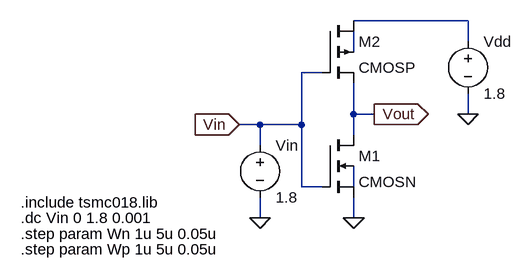
[diagram p0: schematic Assignment 6.asc]
Assignment 6.asc, the LTspice schematic file:
Version 4
SHEET 1 880 680
WIRE 224 -64 48 -64
WIRE 224 -32 224 -64
WIRE 48 -16 48 -48
WIRE 0 16 -32 16
WIRE 48 80 48 32
WIRE 80 80 48 80
WIRE 224 80 224 48
WIRE -96 96 -128 96
WIRE -32 96 -32 16
WIRE -32 96 -96 96
WIRE 48 112 48 80
WIRE -96 128 -96 96
WIRE -32 192 -32 96
WIRE 0 192 -32 192
WIRE 48 192 48 160
WIRE -96 240 -96 208
WIRE 48 240 48 208
FLAG 80 80 Vout
IOPIN 80 80 Out
FLAG -96 240 0
FLAG 48 240 0
FLAG 224 80 0
FLAG -128 96 Vin
IOPIN -128 96 In
SYMBOL cmosn 0 112 R0
SYMATTR InstName M1
SYMATTR Value2 l=180n w={Wn}
SYMBOL cmosp 0 -64 R0
SYMATTR InstName M2
SYMATTR Value2 l=180n w={Wp}
SYMBOL voltage -96 112 R0
SYMATTR InstName Vin
SYMATTR Value 1.8
SYMBOL voltage 224 -48 R0
SYMATTR InstName Vdd
SYMATTR Value 1.8
TEXT -464 216 Left 2 !.include tsmc018.lib
TEXT -464 240 Left 2 !.dc Vin 0 1.8 0.001
TEXT -464 288 Left 2 !.step param Wp 1u 5u 0.05u
TEXT -464 264 Left 2 !.step param Wn 1u 5u 0.05u

The netlist it stands for:
* Assignment 6.asc
M1 Vout Vin 0 N003 CMOSN l=180n w={Wn}
M2 N001 Vin Vout N002 CMOSP l=180n w={Wp}
Vin Vin 0 1.8
Vdd N001 0 1.8
.model NMOS NMOS
.model PMOS PMOS
.lib standard.mos
.include tsmc018.lib
.dc Vin 0 1.8 0.001
.step param Wp 1u 5u 0.05u
.step param Wn 1u 5u 0.05u
.backanno
.end